# Altium schematic sheet VGA.SchDoc
size 431 x 279 mm
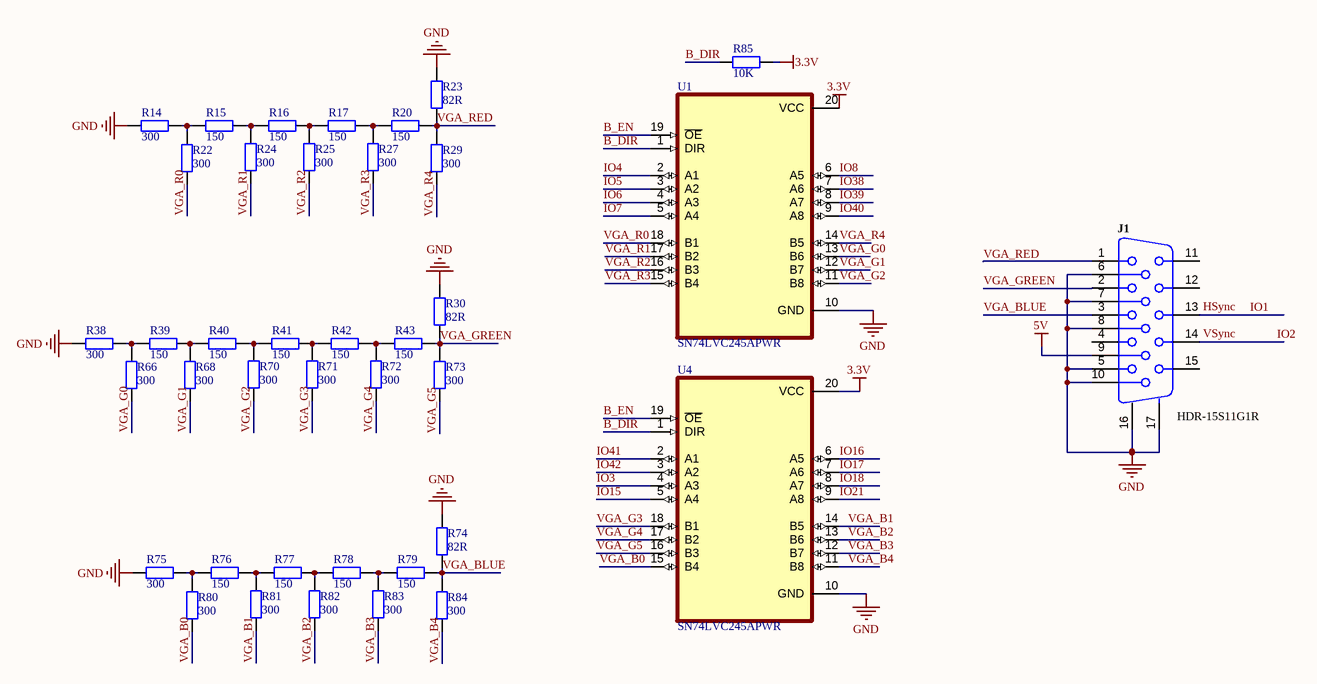
[diagram p0: VGA.SchDoc]

## Parts
J1  HDR-15S11G1R  [DB15-VGA-Female]
R14  value 300  [RES-0603]  (hidden comment: Res2)
R15  value 150  [RES-0603]  (hidden comment: Res2)
R16  value 150  [RES-0603]  (hidden comment: Res2)
R17  value 150  [RES-0603]  (hidden comment: Res2)
R20  value 150  [RES-0603]  (hidden comment: Res2)
R22  value 300  [RES-0603]  (hidden comment: Res2)
R23  value 82R  [RES-0603]  (hidden comment: Res2)
R24  value 300  [RES-0603]  (hidden comment: Res2)
R25  value 300  [RES-0603]  (hidden comment: Res2)
R27  value 300  [RES-0603]  (hidden comment: Res2)
R29  value 300  [RES-0603]  (hidden comment: Res2)
R30  value 82R  [RES-0603]  (hidden comment: Res2)
R38  value 300  [RES-0603]  (hidden comment: Res2)
R39  value 150  [RES-0603]  (hidden comment: Res2)
R40  value 150  [RES-0603]  (hidden comment: Res2)
R41  value 150  [RES-0603]  (hidden comment: Res2)
R42  value 150  [RES-0603]  (hidden comment: Res2)
R43  value 150  [RES-0603]  (hidden comment: Res2)
R66  value 300  [RES-0603]  (hidden comment: Res2)
R68  value 300  [RES-0603]  (hidden comment: Res2)
R70  value 300  [RES-0603]  (hidden comment: Res2)
R71  value 300  [RES-0603]  (hidden comment: Res2)
R72  value 300  [RES-0603]  (hidden comment: Res2)
R73  value 300  [RES-0603]  (hidden comment: Res2)
R74  value 82R  [RES-0603]  (hidden comment: Res2)
R75  value 300  [RES-0603]  (hidden comment: Res2)
R76  value 150  [RES-0603]  (hidden comment: Res2)
R77  value 150  [RES-0603]  (hidden comment: Res2)
R78  value 150  [RES-0603]  (hidden comment: Res2)
R79  value 150  [RES-0603]  (hidden comment: Res2)
R80  value 300  [RES-0603]  (hidden comment: Res2)
R81  value 300  [RES-0603]  (hidden comment: Res2)
R82  value 300  [RES-0603]  (hidden comment: Res2)
R83  value 300  [RES-0603]  (hidden comment: Res2)
R84  value 300  [RES-0603]  (hidden comment: Res2)
R85  value 10K  [RES-0603]  (hidden comment: Res2)
U1  SN74LVC245APWR  [SOP65P640X120-20N]
U4  SN74LVC245APWR  [SOP65P640X120-20N]

## Nets
3.3V: R85.1 U1.20(VCC) U4.20(VCC)
5V: J1.9
GND: J1.5 J1.6 J1.7 J1.8 J1.10 J1.16(MH1) J1.17(MH2) R14.2 R23.2 R30.2 R38.2 R74.2 R75.2 U1.10(GND) U4.10(GND)
B_DIR: R85.2 U1.1(DIR) U4.1(DIR)
B_EN: U1.19(~{OE}) U4.19(~{OE})
IO1: J1.13
IO2: J1.14
IO3: U4.4(A3)
IO4: U1.2(A1)
IO5: U1.3(A2)
IO6: U1.4(A3)
IO7: U1.5(A4)
IO8: U1.6(A5)
IO15: U4.5(A4)
IO16: U4.6(A5)
IO17: U4.7(A6)
IO18: U4.8(A7)
IO21: U4.9(A8)
IO38: U1.7(A6)
IO39: U1.8(A7)
IO40: U1.9(A8)
IO41: U4.2(A1)
IO42: U4.3(A2)
VGA_B0: R80.2 U4.15(B4)
VGA_B1: R81.2 U4.14(B5)
VGA_B2: R82.2 U4.13(B6)
VGA_B3: R83.2 U4.12(B7)
VGA_B4: R84.2 U4.11(B8)
VGA_BLUE: J1.3 R74.1 R79.1 R84.1
VGA_G0: R66.2 U1.13(B6)
VGA_G1: R68.2 U1.12(B7)
VGA_G2: R70.2 U1.11(B8)
VGA_G3: R71.2 U4.18(B1)
VGA_G4: R72.2 U4.17(B2)
VGA_G5: R73.2 U4.16(B3)
VGA_GREEN: J1.2 R30.1 R43.1 R73.1
VGA_R0: R22.2 U1.18(B1)
VGA_R1: R24.2 U1.17(B2)
VGA_R2: R25.2 U1.16(B3)
VGA_R3: R27.2 U1.15(B4)
VGA_R4: R29.2 U1.14(B5)
VGA_RED: J1.1 R20.1 R23.1 R29.1
NetR14_1: R14.1 R15.2 R22.1
NetR15_1: R15.1 R16.2 R24.1
NetR16_1: R16.1 R17.2 R25.1
NetR17_1: R17.1 R20.2 R27.1
NetR38_1: R38.1 R39.2 R66.1
NetR39_1: R39.1 R40.2 R68.1
NetR40_1: R40.1 R41.2 R70.1
NetR41_1: R41.1 R42.2 R71.1
NetR42_1: R42.1 R43.2 R72.1
NetR75_1: R75.1 R76.2 R80.1
NetR76_1: R76.1 R77.2 R81.1
NetR77_1: R77.1 R78.2 R82.1
NetR78_1: R78.1 R79.2 R83.1

Not connected (* = marked no-connect by the designer): J1 4 11 12 15

## Notes on the sheet
- Labels drawn without touching a wire or pin: HSync, VSync
- DWG. NO.
- REV.
- SHT.
- THIS DOCUMENT AND THE DATA DISCLOSED HEREIN OR HEREWITH IS THE PROPERTY OF ALTIUM LIMITED AND MAY BE FREELY DISTRIBUTED IN WHOLE. NO RIGHTS ARE RESERVED OR EXPRESS OR IMPLIED WARANTEE GIVEN.
- REVISION
- DESCRIPTION
- DATE
- APPROVED
- ENG:
- APPROVALS
- PROJECT
- DSN:
- CHK:
- REFERENCE DOCUMENTS
- PROJECT REVISION:
- TITLE
- DOCUMENT REVISION:
- DESIGN ITEM:
- BOM:
- FAB DWG:
- PCB DWG:
- ASSY DWG:
- SCALE:
- SIZE
- B
- CAGE CODE
- FILE NAME
- DWG NO.
- SHEET
- OF
- REV

## Library data of the parts
J1 = CON 15 Female: Socket, High-Density DB15 (HD15) R/A Female Through-hole; Connector type: Right Angle; Max Current: 3 A; Category: Connector; Mounting Technology: Through-Hole; Pin Count: 15; Status: Unreleased
R14-R17 R20 R22-R25 R27 R29 R30 R38-R43 R66 R68 R70-R85 = Res2: Resistor; Published: 8-Jun-2000; LatestRevisionDate: 17-Jul-2002; LatestRevisionNote: Re-released for DXP Platform.; PackageReference: AXIAL-0.4; Publisher: Altium Limited; PackageDescription: Axial Device, Thru-Hole; 2 Leads; 0.4 in Pin Spacing
U1 U4 = SN74LVC245APWR: Octal Bus Transceiver With 3-State Outputs 20-TSSOP -40 to 125; MF: Texas Instruments; Check_prices: https://www.snapeda.com/parts/SN74LVC245APWR/Texas%20Instruments/view-part/213920/?ref=eda; Package: TSSOP-20 Texas Instruments; MP: SN74LVC245APWR; Purchase-URL: https://pricing.snapeda.com/search/part/SN74LVC245APWR/?ref=eda; SnapEDA_Link: https://www.snapeda.com/parts/SN74LVC245APWR/Texas%20Instruments/view-part/213920/?ref=snap; Value: *; Price: None; Availability: Good